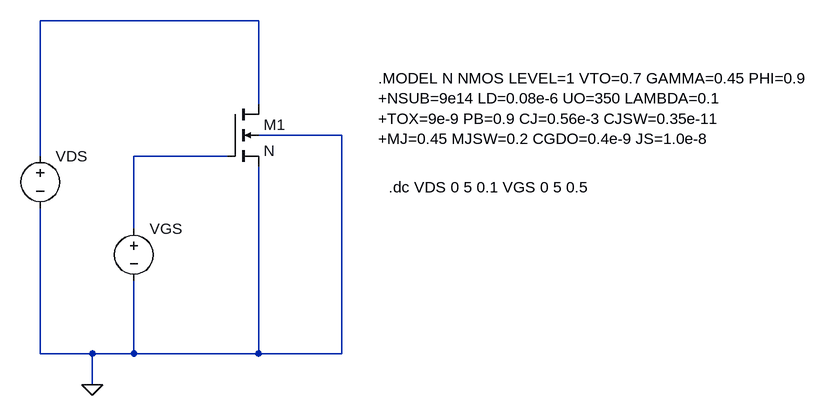
[diagram p0: schematic Draft1.asc]
Draft1.asc, the LTspice schematic file:
Version 4
SHEET 1 1096 680
WIRE 224 -16 -112 -16
WIRE 224 112 224 -16
WIRE 352 160 224 160
WIRE -112 192 -112 -16
WIRE 176 192 32 192
WIRE 32 304 32 192
WIRE -112 496 -112 272
WIRE -32 496 -112 496
WIRE 32 496 32 384
WIRE 32 496 -32 496
WIRE 224 496 224 208
WIRE 224 496 32 496
WIRE 352 496 352 160
WIRE 352 496 224 496
WIRE -32 544 -32 496
FLAG -32 544 0
SYMBOL nmos4 176 112 R0
SYMATTR InstName M1
SYMATTR Value N
SYMBOL voltage -112 176 R0
WINDOW 123 0 0 Left 0
WINDOW 39 0 0 Left 0
SYMATTR InstName VDS
SYMATTR Value ""
SYMBOL voltage 32 288 R0
WINDOW 123 0 0 Left 0
WINDOW 39 0 0 Left 0
SYMATTR InstName VGS
SYMATTR Value ""
TEXT 408 72 Left 2 !.MODEL N NMOS LEVEL=1 VTO=0.7 GAMMA=0.45 PHI=0.9\n+NSUB=9e14 LD=0.08e-6 UO=350 LAMBDA=0.1\n+TOX=9e-9 PB=0.9 CJ=0.56e-3 CJSW=0.35e-11\n+MJ=0.45 MJSW=0.2 CGDO=0.4e-9 JS=1.0e-8
TEXT 424 240 Left 2 !.dc VDS 0 5 0.1 VGS 0 5 0.5

The netlist it stands for:
* Draft1.asc
M1 N001 N002 0 0 N
VDS N001 0
VGS N002 0
.model NMOS NMOS
.model PMOS PMOS
.lib standard.mos
.MODEL N NMOS LEVEL=1 VTO=0.7 GAMMA=0.45 PHI=0.9
+NSUB=9e14 LD=0.08e-6 UO=350 LAMBDA=0.1
+TOX=9e-9 PB=0.9 CJ=0.56e-3 CJSW=0.35e-11
+MJ=0.45 MJSW=0.2 CGDO=0.4e-9 JS=1.0e-8
.dc VDS 0 5 0.1 VGS 0 5 0.5
.backanno
.end